# EAGLE design IMU-Module v1.0 (EAGLE 6.5.0)
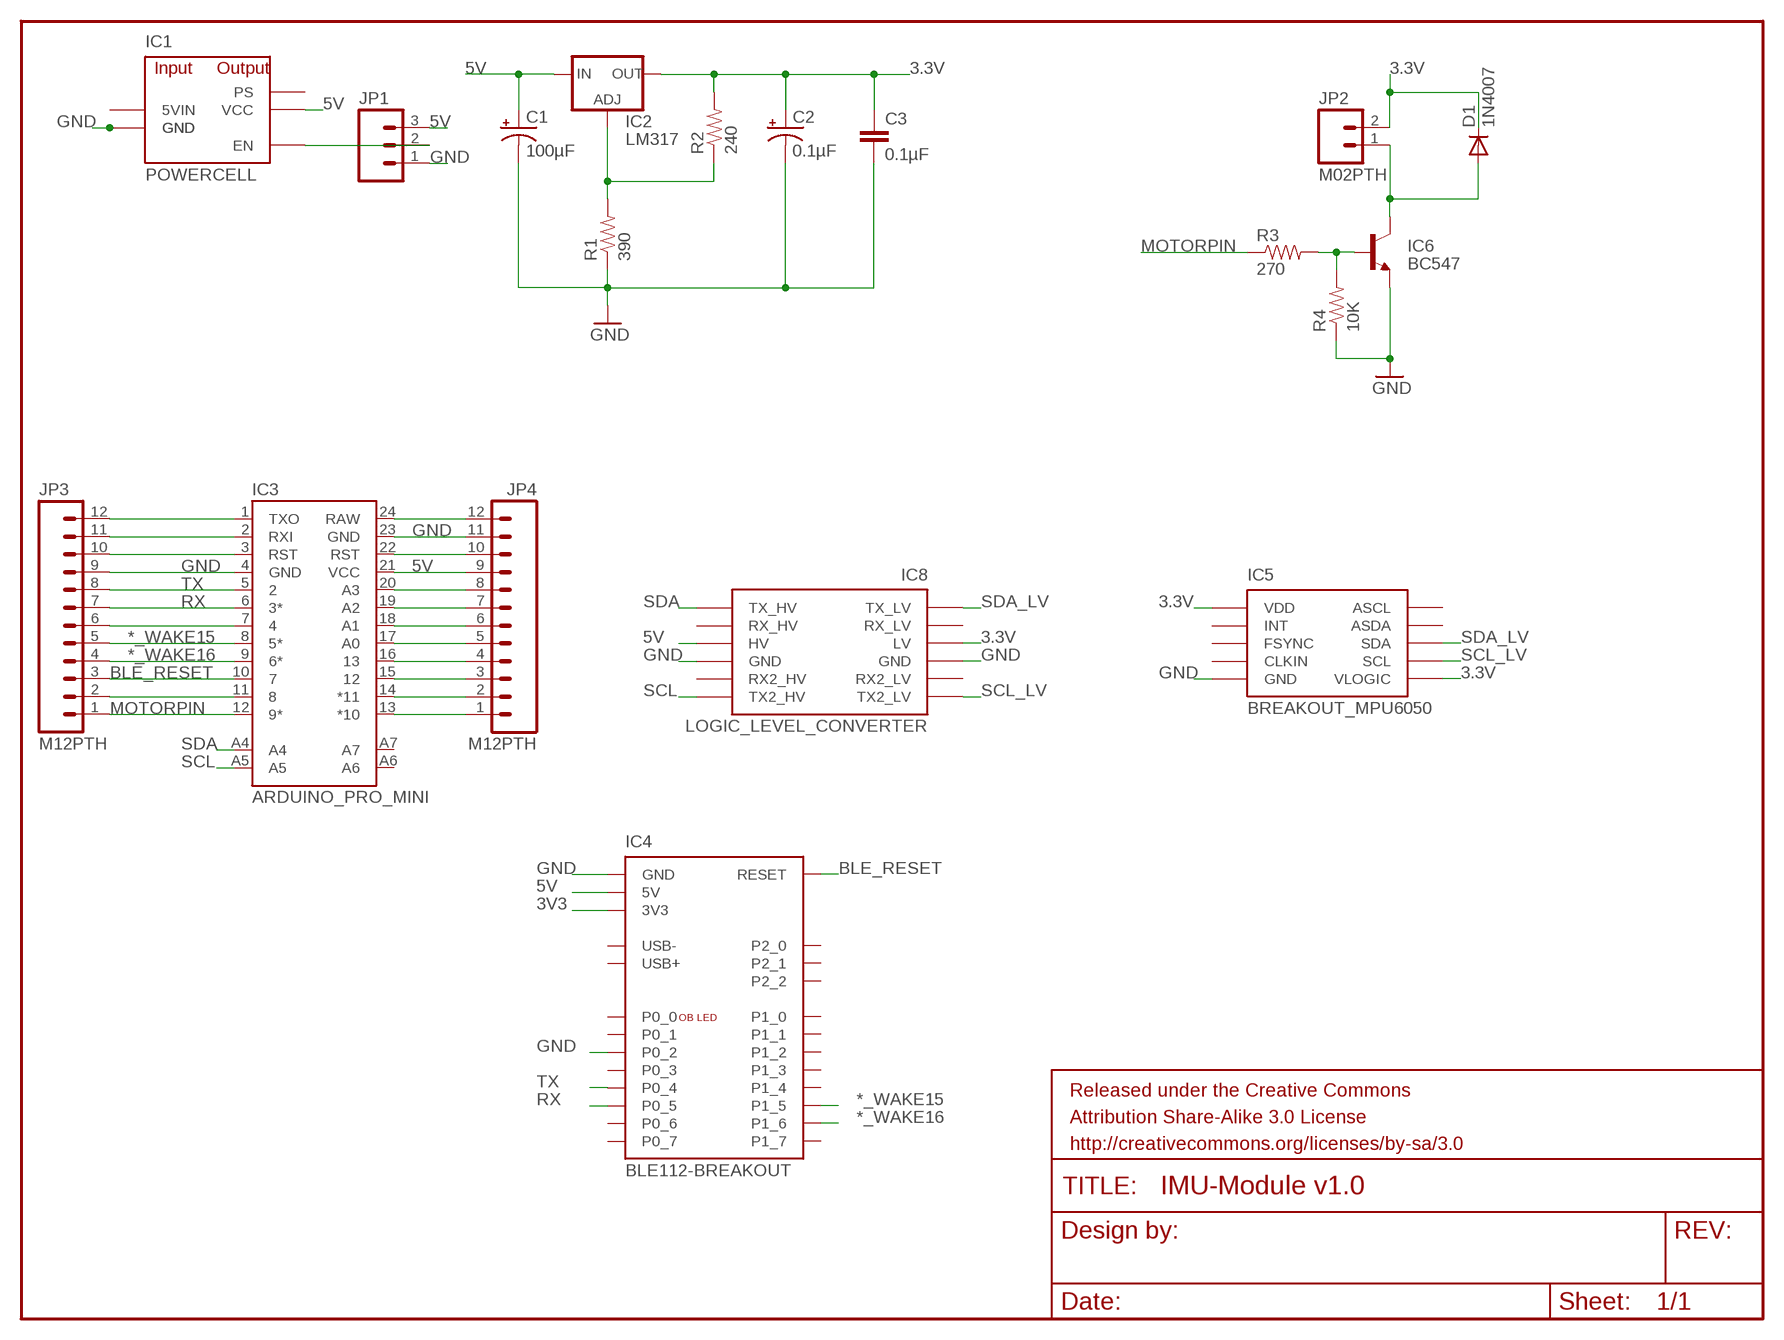
[diagram p0: schematic, sheet 1]

## Parts
C1  100µF  CAP_POLPTH1  [CPOL-RADIAL-100UF-25V]
C2  0.1µF  CAP_POLPTH2  [CPOL-RADIAL-10UF-25V]
C3  0.1µF  CAP1206  [1206]
D1  1N4007  DIODE  [DIODE-1N4001-KIT]
FRAME1  FRAME-LETTER  [CREATIVE_COMMONS]
IC1  POWERCELL  POWERCELL  [POWERCELL]
IC2  LM317  V_REG_317SMD  [SOT223]
IC3  ARDUINO_PRO_MINI  [ARDUINO_PRO_MINI]
IC4  BLE112-BREAKOUT  [BLE112-BREAKOUT]
IC5  BREAKOUT_MPU6050  [BREAKOUT_MPU6050]
IC6  BC547  [TO-92]
IC8  LOGIC_LEVEL_CONVERTER  [LOGIC_LEVEL_CONVERTER]
JP1  M03PTH  [1X03]
JP2  M02PTH  [1X02]
JP3  M12PTH  [1X12]
JP4  M12PTH  [1X12]
R1  390  RESISTOR1206  [1206]
R2  240  RESISTOR1206  [1206]
R3  270  RESISTOR1206  [1206]
R4  10K  RESISTOR1206  [1206]

## Nets
3.3V: C2.1(+) C3.1 D1.C IC2.2(OUT) IC5.VDD IC5.VLOGIC IC8.LV JP2.2 R2.2
3V3: IC4.3V3
5V: C1.1(+) IC1.VCC IC2.3(IN) IC3.21(VCC) IC4.5V IC8.HV JP1.3 JP4.9
*_WAKE15: IC3.8(5*) IC4.P15(P1_5) JP3.5
*_WAKE16: IC3.9(6*) IC4.P16(P1_6) JP3.4
BLE_RESET: IC3.10 IC4.RESET JP3.3
GND: C1.2(-) C2.2(-) C3.2 IC1.GND@1(GND) IC1.GND@2(GND) IC3.4(GND) IC3.23(GND) IC4.GND IC4.P02(P0_2) IC5.GND IC6.3(E) IC8.GND@1(GND) IC8.GND@2(GND) JP1.1 JP3.9 JP4.11 R1.1 R4.1
MOTORPIN: IC3.12(9*) JP3.1 R3.1
N$1: IC6.2(B) R3.2 R4.2
N$2: IC1.EN JP1.2
N$3: IC2.1(ADJ) R1.2 R2.1
N$4: D1.A IC6.1(C) JP2.1
N$5: IC3.7 JP3.6
N$6: IC3.3(RST) JP3.10
N$7: IC3.2(RXI) JP3.11
N$8: IC3.1(TXO) JP3.12
N$9: IC3.11 JP3.2
N$11: IC3.20(A3) JP4.8
N$12: IC3.19(A2) JP4.7
N$13: IC3.18(A1) JP4.6
N$14: IC3.17(A0) JP4.5
N$15: IC3.16 JP4.4
N$16: IC3.15 JP4.3
N$17: IC3.14(*11) JP4.2
N$18: IC3.13(*10) JP4.1
N$20: IC3.22(RST) JP4.10
N$22: IC3.24(RAW) JP4.12
RX: IC3.6(3*) IC4.P05(P0_5) JP3.7
SCL: IC3.A5 IC8.HV_TXO_2(TX2_HV)
SCL_LV: IC5.SCL IC8.LV_TXI_2(TX2_LV)
SDA: IC3.A4 IC8.HV_TXO_1(TX_HV)
SDA_LV: IC5.SDA IC8.LV_TXI_1(TX_LV)
TX: IC3.5 IC4.P04(P0_4) JP3.8
Unconnected: IC1.PS IC3.A6 IC3.A7 IC4.P00(P0_0) IC4.P01(P0_1) IC4.P03(P0_3) IC4.P06(P0_6) IC4.P07(P0_7) IC4.P10(P1_0) IC4.P11(P1_1) IC4.P12(P1_2) IC4.P13(P1_3) IC4.P14(P1_4) IC4.P17(P1_7) IC4.P20(P2_0) IC4.P21(P2_1) IC4.P22(P2_2) IC4.USB+ IC4.USB- IC5.ASCL IC5.ASDA IC5.CLK(CLKIN) IC5.FSYNC IC5.INT

## Power pins joined to a net without a drawn wire
5VIN: IC1.5VIN
RX2_HV: IC8.HV_RXI_2(RX2_HV)
RX2_LV: IC8.LV_RXO_2(RX2_LV)
RX_HV: IC8.HV_RXI_1(RX_HV)
RX_LV: IC8.LV_RXO_1(RX_LV)

## Library data of the parts
C1 C2 = SparkFun-Passives:CAP_POL: Capacitor Polarized These are standard SMD and PTH capacitors. Normally 10uF, 47uF, and 100uF in electrolytic and tantalum varieties. Always verify the external diameter of the through hole cap, it varies with capacity, voltage, and manufacturer. The EIA devices should be standard.
C3 = SparkFun-Passives:CAP: Capacitor Standard 0603 ceramic capacitor, and 0.1" leaded capacitor.
D1 = SparkFun-DiscreteSemi:DIODE: Diode These are standard reverse protection diodes and small signal diodes. SMA package can handle up to about 1A. SOD-323 can handle about 200mA. What the SOD-323 package when ordering, there are some mfgs out there that are 5-pin packages.
FRAME1 = SparkFun-Aesthetics:FRAME-LETTER: Schematic Frame Standard 8.5x11 US Letter frame
IC1 = MyLibrary:POWERCELL
IC2 = SparkFun-PowerIC:V_REG_317: Voltage Regulator Standard LM317 adjustable voltage regulator. AOI (Adjust Output Input). Google 'LM317 Calculator' for easy to use app to get the two resistor values needed. 240/720 for 5V output. 240/390 for 3.3V output. Spark Fun Electronics SKU : COM-00527
IC3 = SparkFun-Boards:ARDUINO_PRO_MINI
IC4 = MyLibrary:BLE112-BREAKOUT
IC5 = MyLibrary:BREAKOUT_MPU6050
IC6 = SparkFun-DiscreteSemi:BC547
IC8 = SparkFun-Boards:LOGIC_LEVEL_CONVERTER: Logic Level Converter (3.3v - 5v) https://www.sparkfun.com/products/8745
JP1 = SparkFun-Connectors:M03: Header 3 Standard 3-pin 0.1" header. Use with straight break away headers (SKU : PRT-00116), right angle break away headers (PRT-00553), swiss pins (PRT-00743), machine pins (PRT-00117), and female headers (PRT-00115). Molex polarized connector foot print use with SKU : PRT-08232 with associated crimp pins and housings.
JP2 = SparkFun-Connectors:M02: Standard 2-pin 0.1" header. Use with - straight break away headers ( PRT-00116) - right angle break away headers (PRT-00553) - swiss pins (PRT-00743) - machine pins (PRT-00117) - female headers (PRT-00115) Molex polarized connector foot print use with: PRT-08233 with associated crimp pins and housings. 2.54_SCREWTERM for use with PRT-10571. 3.5mm Screw Terminal footprints for PRT-08084 5mm Screw Terminal footprints for use with PRT-08433
JP3 JP4 = SparkFun-Connectors:M12: Header 12 Standard 12-pin 0.1" header. Use with straight break away headers (SKU : PRT-00116), right angle break away headers (PRT-00553), swiss pins (PRT-00743), machine pins (PRT-00117), and female headers (PRT-00115).
R1-R4 = SparkFun-Passives:RESISTOR: Resistor Basic schematic elements and footprints for 0603, 1206, and PTH resistors.

## Board
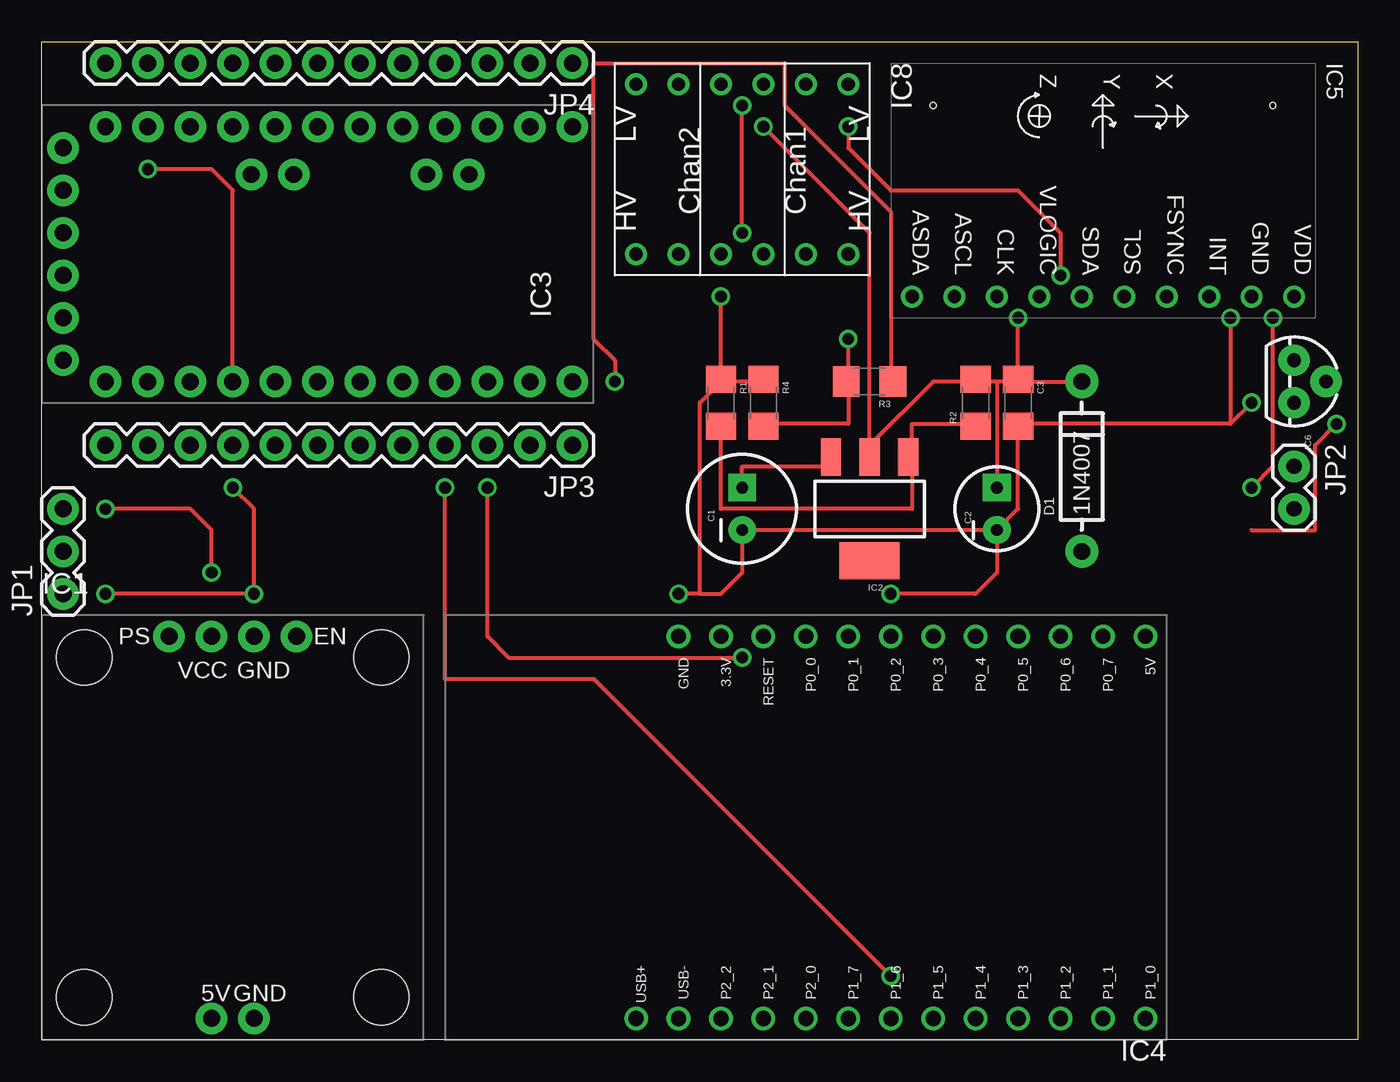
[diagram p1: board, top side]
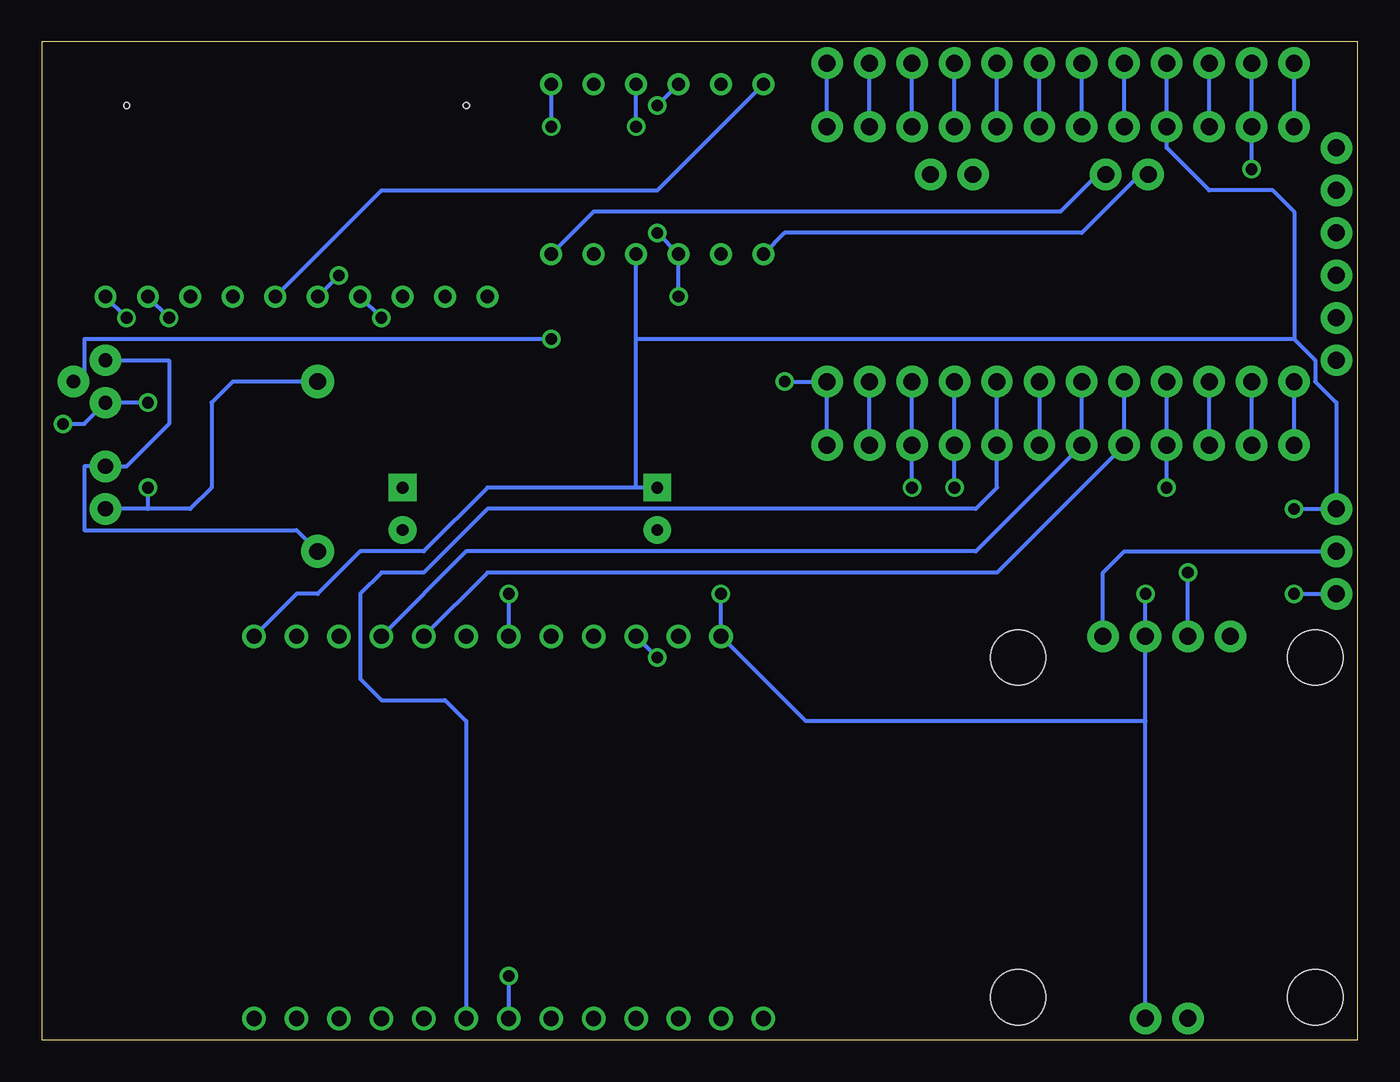
[diagram p2: board, bottom side, seen from below]

Size 78.74 x 59.69 mm. Coordinates in mm from the lower left corner, seen from the top.
Outline: 0,0 0,59.69 78.74,59.69 78.74,0 0,0
Copper layers (1*16): Top 0.035mm / dielectric 1.5mm / Bottom 0.035mm
Design rules "default *": minimum track width 10mil, minimum drill 0.7mm, track to track 8mil, track to pad 8mil, pad to pad 8mil, via to via 8mil, smd to smd 8mil, copper to edge 40mil, drill to drill 8mil, minimum pad ring 10mil, minimum via ring 8mil, stop-mask expansion 4mil, vias tented up to drill 0mil, thermal gap 10mil

### Footprints (pad centres in the part's own frame; a part is rotated, then mirrored left to right if it is on the bottom)
CPOL-RADIAL-100UF-25V = drill 0.7 pad 1.651 square: 1 1.27,0 | drill 0.7 pad 1.651: 2 -1.27,0
CPOL-RADIAL-10UF-25V = drill 0.7 pad 1.651 square: 1 1.27,0 | drill 0.7 pad 1.651: 2 -1.27,0
1206 = smd 1.6 x 1.8: 1 -1.4,0; 2 1.4,0
DIODE-1N4001-KIT = drill 1 pad 1.981: A -5.08,0; C 5.08,0
POWERCELL = drill 1.016 pad 1.88: 5VIN 10.16,1.27; EN 15.24,24.13; GND@1 12.7,24.13; GND@2 12.7,1.27; PS 7.62,24.13; VCC 10.16,24.13 | hole 3.302: 2.54,22.86; 20.32,22.86; 2.54,2.54; 20.32,2.54
SOT223 = smd 1.219 x 2.235: 1 -2.311,-3.099; 2 0,-3.099; 3 2.311,-3.099 | smd 3.6 x 2.2: 4 0,3.099
ARDUINO_PRO_MINI = drill 1.016 pad 1.88: 1 -7.62,12.7; 2 -7.62,10.16; 3 -7.62,7.62; 4 -7.62,5.08; 5 -7.62,2.54; 6 -7.62,0; 7 -7.62,-2.54; 8 -7.62,-5.08; 9 -7.62,-7.62; 10 -7.62,-10.16; 11 -7.62,-12.7; 12 -7.62,-15.24; 13 7.62,-15.24; 14 7.62,-12.7; 15 7.62,-10.16; 16 7.62,-7.62; 17 7.62,-5.08; 18 7.62,-2.54; 19 7.62,0; 20 7.62,2.54; 21 7.62,5.08; 22 7.62,7.62; 23 7.62,10.16; 24 7.62,12.7; A4 4.763,1.429; A5 4.763,3.969; A6 4.763,-9.049; A7 4.763,-6.509; BLK -6.35,15.24; GND -3.81,15.24; GRN 6.35,15.24; RXI 1.27,15.24; TXO 3.81,15.24; VCC -1.27,15.24
BLE112-BREAKOUT = drill 0.9: 3V3 26.67,1.27; 5V 1.27,1.27; GND 29.21,1.27; P00 21.59,1.27; P01 19.05,1.27; P02 16.51,1.27; P03 13.97,1.27; P04 11.43,1.27; P05 8.89,1.27; P06 6.35,1.27; P07 3.81,1.27; P10 1.27,24.13; P11 3.81,24.13; P12 6.35,24.13; P13 8.89,24.13; P14 11.43,24.13; P15 13.97,24.13; P16 16.51,24.13; P17 19.05,24.13; P20 21.59,24.13; P21 24.13,24.13; P22 26.67,24.13; RESET 24.13,1.27; USB+ 31.75,24.13; USB- 29.21,24.13
BREAKOUT_MPU6050 = drill 0.8: ASCL 3.81,1.27; ASDA 1.27,1.27; CLK 6.35,1.27; FSYNC 16.51,1.27; GND 21.59,1.27; INT 19.05,1.27; SCL 13.97,1.27; SDA 11.43,1.27; VDD 24.13,1.27; VLOGIC 8.89,1.27 | hole 0.33: 2.54,12.7; 22.86,12.7
TO-92 = drill 0.813 pad 1.88: 1 -1.27,0; 2 0,1.905; 3 1.27,0
LOGIC_LEVEL_CONVERTER = drill 0.8: GND@1 1.27,6.35; GND@2 11.43,6.35; HV 11.43,8.89; HV_RXI_1 11.43,11.43; HV_RXI_2 11.43,3.81; HV_TXO_1 11.43,13.97; HV_TXO_2 11.43,1.27; LV 1.27,8.89; LV_RXO_1 1.27,11.43; LV_RXO_2 1.27,3.81; LV_TXI_1 1.27,13.97; LV_TXI_2 1.27,1.27
1X03 = drill 1.016 pad 1.88: 1 0,0; 2 2.54,0; 3 5.08,0
1X02 = drill 0.9 pad 1.88: 1 0,0; 2 2.54,0
1X12 = drill 1.016 pad 1.88: 1 0,0; 2 2.54,0; 3 5.08,0; 4 7.62,0; 5 10.16,0; 6 12.7,0; 7 15.24,0; 8 17.78,0; 9 20.32,0; 10 22.86,0; 11 25.4,0; 12 27.94,0

### Placement (x,y rotation side)
C1  41.91,31.75 90 top
C2  57.15,31.75 90 top
C3  58.42,38.1 270 top
D1  62.23,34.29 90 top
FRAME1  22.86,-8.89 0 top  (outside the outline)
IC1  0,0 0 top
IC2  49.53,31.75 180 top
IC3  16.51,46.99 90 top
IC4  67.31,25.4 180 top
IC5  50.8,43.18 0 top
IC6  74.93,39.37 270 top
IC8  34.29,58.42 270 top
JP1  1.27,26.67 90 top
JP2  74.93,34.29 270 top
JP3  31.75,35.56 180 top
JP4  31.75,58.42 180 top
R1  40.64,38.1 270 top
R2  55.88,38.1 90 top
R3  49.53,39.37 180 top
R4  43.18,38.1 270 top

### Tracks (layer width: path | path; a pad name or v marks a point on that pad's centre or on a via)
3.3V  (via drill 0.7)
  Top 0.254: v73.66,43.18 73.66,34.29 v72.39,33.02 | 58.42,39.37 57.15,39.37 | 57.15,39.37 55.88,39.37 | 49.53,35.56 53.34,39.37 55.88,39.37 | 55.88,39.37 R2.2 | v43.18,54.61 49.53,48.26 49.53,35.56 | 49.53,35.56 IC2.2 | v58.42,43.18 C3.1 58.42,39.37 | 57.15,39.37 C2.1 | 58.42,39.37 D1.C
  Bottom 0.254: D1.C 67.31,39.37 68.58,38.1 68.58,33.02 69.85,31.75 72.39,31.75 | 72.39,31.75 JP2.2 | v72.39,33.02 72.39,31.75 | v73.66,43.18 IC5.VDD | v43.18,54.61 IC8.LV | v58.42,43.18 IC5.VLOGIC
5V  (via drill 0.7)
  Top 0.254: C1.1 41.91,34.29 46.99,34.29 IC2.3 | v10.16,27.94 10.16,30.48 8.89,31.75 v3.81,31.75
  Bottom 0.254: 43.18,33.02 43.18,41.91 | 43.18,41.91 IC8.HV | C1.1 43.18,33.02 | IC4.5V 63.5,26.67 62.23,26.67 59.69,29.21 55.88,29.21 52.07,33.02 43.18,33.02 | 3.81,41.91 43.18,41.91 | IC1.VCC v10.16,27.94 | v3.81,31.75 JP1.3 1.27,38.1 2.54,39.37 2.54,40.64 3.81,41.91 | JP4.9 IC3.21 11.43,53.34 8.89,50.8 5.08,50.8 3.81,49.53 3.81,41.91
*_WAKE15
  Bottom 0.254: IC4.P15 53.34,19.05 54.61,20.32 58.42,20.32 59.69,21.59 59.69,26.67 58.42,27.94 55.88,27.94 52.07,31.75 22.86,31.75 21.59,33.02 JP3.5 IC3.8
*_WAKE16  (via drill 0.7)
  Top 0.254: v24.13,33.02 24.13,21.59 33.02,21.59 v50.8,3.81
  Bottom 0.254: IC3.9 JP3.4 v24.13,33.02 | v50.8,3.81 IC4.P16
BLE_RESET  (via drill 0.7)
  Top 0.254: v41.91,22.86 27.94,22.86 26.67,24.13 v26.67,33.02
  Bottom 0.254: IC3.10 JP3.3 v26.67,33.02 | v41.91,22.86 IC4.RESET
GND  (via drill 0.7)
  Top 0.254: 71.12,36.83 58.42,36.83 C3.2 58.42,31.75 C2.2 | 72.39,30.48 76.2,30.48 76.2,35.56 v77.47,36.83 | 40.64,39.37 43.18,39.37 R4.1 | C2.2 C1.2 41.91,27.94 40.64,26.67 39.37,26.67 | 40.64,39.37 39.37,38.1 39.37,26.67 | 40.64,39.37 R1.1 v40.64,44.45 | IC3.4 11.43,50.8 10.16,52.07 v6.35,52.07 | v3.81,26.67 v12.7,26.67 12.7,31.75 v11.43,33.02 | C2.2 57.15,27.94 55.88,26.67 v50.8,26.67 | 39.37,26.67 v38.1,26.67 | v71.12,43.18 71.12,36.83 | 71.12,36.83 v72.39,38.1 | v41.91,48.26 v41.91,55.88
  Bottom 0.254: 12.7,19.05 33.02,19.05 IC4.GND v38.1,26.67 | IC1.GND@2 12.7,19.05 | 12.7,19.05 IC1.GND@1 v12.7,26.67 | v3.81,26.67 JP1.1 | IC3.4 JP3.9 v11.43,33.02 | v50.8,26.67 IC4.P02 | v71.12,43.18 IC5.GND | v72.39,38.1 IC6.3 76.2,36.83 v77.47,36.83 | v41.91,48.26 IC8.GND@2 v40.64,44.45 | v41.91,55.88 IC8.GND@1 | v6.35,52.07 IC3.23 JP4.11
MOTORPIN  (via drill 0.7)
  Top 0.254: R3.1 50.8,39.37 50.8,49.53 44.45,55.88 44.45,58.42 33.02,58.42 33.02,41.91 34.29,40.64 v34.29,39.37
  Bottom 0.254: JP3.1 IC3.12 v34.29,39.37
N$1  (via drill 0.7)
  Top 0.254: 48.26,39.37 48.26,36.83 43.18,36.83 R4.2 | 48.26,39.37 v48.26,41.91 | 48.26,39.37 R3.2
  Bottom 0.254: v48.26,41.91 76.2,41.91 76.2,39.37 IC6.2
N$2
  Bottom 0.254: JP1.2 13.97,29.21 15.24,27.94 IC1.EN
N$3
  Top 0.254: 40.64,36.83 R1.2 40.64,31.75 52.07,31.75 52.07,34.29 IC2.1 52.07,35.56 52.07,36.83 55.88,36.83 R2.1
N$4
  Bottom 0.254: IC6.1 71.12,40.64 71.12,36.83 73.66,34.29 JP2.1 76.2,34.29 76.2,30.48 63.5,30.48 D1.A
N$5
  Bottom 0.254: IC3.7 JP3.6
N$6
  Bottom 0.254: JP3.10 IC3.3
N$7
  Bottom 0.254: JP3.11 IC3.2
N$8
  Bottom 0.254: JP3.12 IC3.1
N$9
  Bottom 0.254: JP3.2 IC3.11
N$10  (via drill 0.7)
  other vias: 71.12,43.18
N$11
  Bottom 0.254: IC3.20 JP4.8
N$12
  Bottom 0.254: IC3.19 JP4.7
N$13
  Bottom 0.254: IC3.18 JP4.6
N$14
  Bottom 0.254: IC3.17 JP4.5
N$15
  Bottom 0.254: IC3.16 JP4.4
N$16
  Bottom 0.254: IC3.15 JP4.3
N$17
  Bottom 0.254: IC3.14 JP4.2
N$18
  Bottom 0.254: IC3.13 JP4.1
N$19  (via drill 0.7)
  other vias: 41.91,48.26
N$20
  Bottom 0.254: IC3.22 JP4.10
N$21  (via drill 0.7)
  other vias: 41.91,55.88
N$22
  Bottom 0.254: IC3.24 JP4.12
N$23  (via drill 0.7)
  other vias: 48.26,54.61
N$24  (via drill 0.7)
  other vias: 60.96,45.72
RX
  Bottom 0.254: IC4.P05 53.34,29.21 22.86,29.21 JP3.7 IC3.6
SCL
  Bottom 0.254: IC8.HV_TXO_2 34.29,48.26 16.51,48.26 12.7,52.07 IC3.A5
SCL_LV
  Bottom 0.254: IC8.LV_TXI_2 41.91,50.8 58.42,50.8 IC5.SCL
SDA
  Bottom 0.254: IC8.HV_TXO_1 45.72,49.53 17.78,49.53 15.24,52.07 IC3.A4
SDA_LV  (via drill 0.7)
  Top 0.254: v48.26,54.61 48.26,53.34 50.8,50.8 58.42,50.8 60.96,48.26 v60.96,45.72
  Bottom 0.254: IC8.LV_TXI_1 v48.26,54.61 | v60.96,45.72 IC5.SDA
TX
  Bottom 0.254: IC4.P04 52.07,27.94 21.59,27.94 JP3.8 IC3.5